# EAGLE design main (EAGLE 9.3.0)
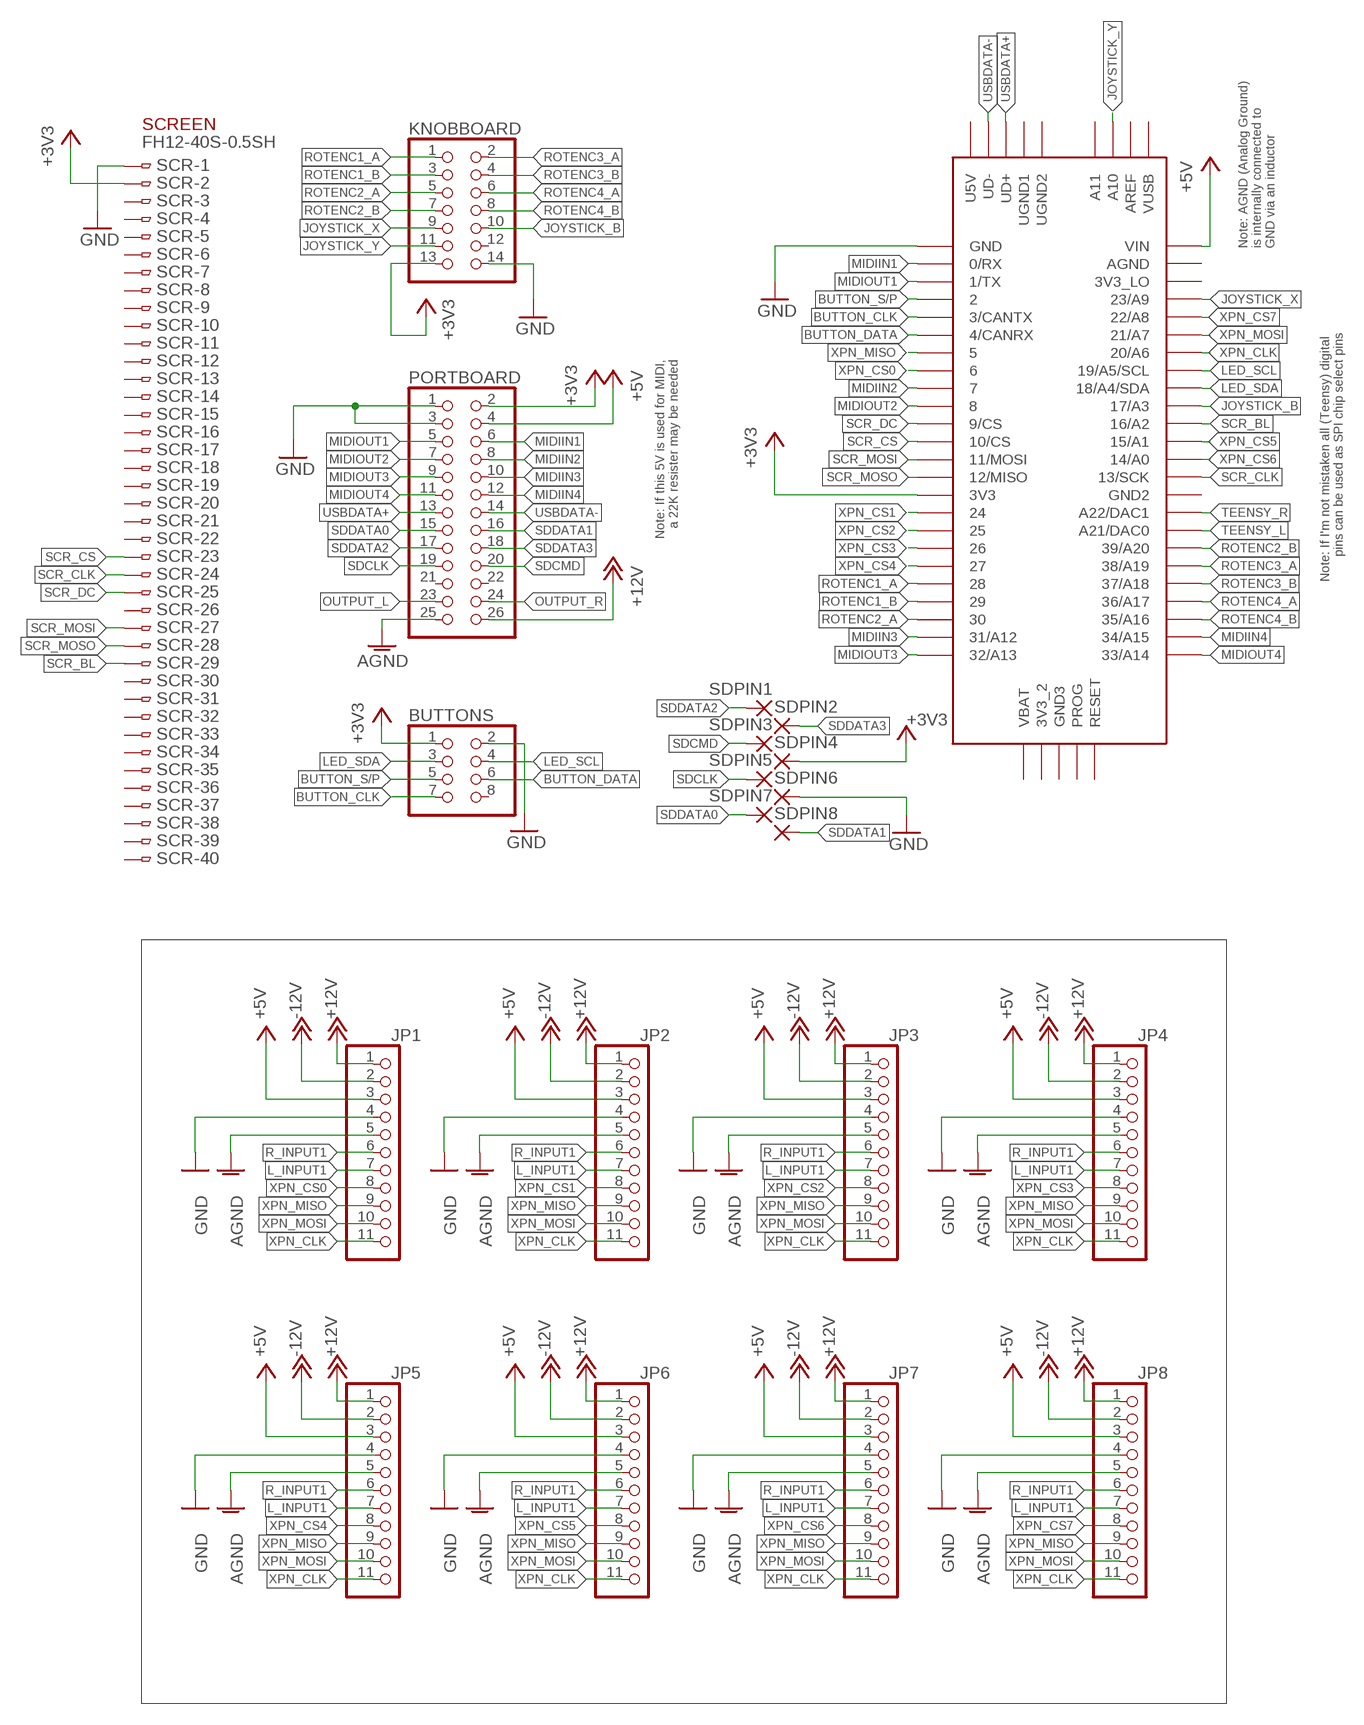
[diagram p0: schematic, sheet 1]

## Parts
BUTTONS  PINHD-2X4  [2X04]
JP1  PINHD-1X11  [1X11]
JP2  PINHD-1X11  [1X11]
JP3  PINHD-1X11  [1X11]
JP4  PINHD-1X11  [1X11]
JP5  PINHD-1X11  [1X11]
JP6  PINHD-1X11  [1X11]
JP7  PINHD-1X11  [1X11]
JP8  PINHD-1X11  [1X11]
KNOBBOARD  PINHD-2X7  [2X07]
PORTBOARD  PINHD-2X13  [2X13]
SCR  FH12-40S-0.5SH  [FH12-40S-0.5SH]
SDPIN1  1,6/0,8  [1,6/0,8]
SDPIN2  1,6/0,8  [1,6/0,8]
SDPIN3  1,6/0,8  [1,6/0,8]
SDPIN4  1,6/0,8  [1,6/0,8]
SDPIN5  1,6/0,8  [1,6/0,8]
SDPIN6  1,6/0,8  [1,6/0,8]
SDPIN7  1,6/0,8  [1,6/0,8]
SDPIN8  1,6/0,8  [1,6/0,8]
TEENSY_3.6  TEENSY_3.5/3.6  [TEENSY_3.5/3.6]

## Nets
+3V3: BUTTONS.1 KNOBBOARD.13 PORTBOARD.2 SCR.2 SDPIN4.1(P) TEENSY_3.6.3V3
+5V: JP1.3 JP2.3 JP3.3 JP4.3 JP5.3 JP6.3 JP7.3 JP8.3 PORTBOARD.4 TEENSY_3.6.VIN
+12V: JP1.1 JP2.1 JP3.1 JP4.1 JP5.1 JP6.1 JP7.1 JP8.1 PORTBOARD.26
-12V: JP1.2 JP2.2 JP3.2 JP4.2 JP5.2 JP6.2 JP7.2 JP8.2
AGND: JP1.5 JP2.5 JP3.5 JP4.5 JP5.5 JP6.5 JP7.5 JP8.5 PORTBOARD.25
BUTTON_CLK: BUTTONS.7 TEENSY_3.6.3/CANTX
BUTTON_DATA: BUTTONS.6 TEENSY_3.6.4/CANRX
BUTTON_S/P: BUTTONS.5 TEENSY_3.6.2
GND: BUTTONS.2 JP1.4 JP2.4 JP3.4 JP4.4 JP5.4 JP6.4 JP7.4 JP8.4 KNOBBOARD.14 PORTBOARD.1 PORTBOARD.3 SCR.1 SDPIN6.1(P) TEENSY_3.6.GND
JOYSTICK_B: KNOBBOARD.10 TEENSY_3.6.17/A3
JOYSTICK_X: KNOBBOARD.9 TEENSY_3.6.23/A9
JOYSTICK_Y: KNOBBOARD.11 TEENSY_3.6.A10
L_INPUT1: JP1.7 JP2.7 JP3.7 JP4.7 JP5.7 JP6.7 JP7.7 JP8.7
LED_SCL: BUTTONS.4 TEENSY_3.6.19/A5/SCL
LED_SDA: BUTTONS.3 TEENSY_3.6.18/A4/SDA
MIDIIN1: PORTBOARD.6 TEENSY_3.6.0/RX
MIDIIN2: PORTBOARD.8 TEENSY_3.6.7
MIDIIN3: PORTBOARD.10 TEENSY_3.6.31/A12
MIDIIN4: PORTBOARD.12 TEENSY_3.6.34/A15
MIDIOUT1: PORTBOARD.5 TEENSY_3.6.1/TX
MIDIOUT2: PORTBOARD.7 TEENSY_3.6.8
MIDIOUT3: PORTBOARD.9 TEENSY_3.6.32/A13
MIDIOUT4: PORTBOARD.11 TEENSY_3.6.33/A14
OUTPUT_L: PORTBOARD.23
OUTPUT_R: PORTBOARD.24
R_INPUT1: JP1.6 JP2.6 JP3.6 JP4.6 JP5.6 JP6.6 JP7.6 JP8.6
ROTENC1_A: KNOBBOARD.1 TEENSY_3.6.28
ROTENC1_B: KNOBBOARD.3 TEENSY_3.6.29
ROTENC2_A: KNOBBOARD.5 TEENSY_3.6.30
ROTENC2_B: KNOBBOARD.7 TEENSY_3.6.39/A20
ROTENC3_A: KNOBBOARD.2 TEENSY_3.6.38/A19
ROTENC3_B: KNOBBOARD.4 TEENSY_3.6.37/A18
ROTENC4_A: KNOBBOARD.6 TEENSY_3.6.36/A17
ROTENC4_B: KNOBBOARD.8 TEENSY_3.6.35/A16
SCR_BL: SCR.29 TEENSY_3.6.16/A2
SCR_CLK: SCR.24 TEENSY_3.6.13/SCK
SCR_CS: SCR.23 TEENSY_3.6.10/CS
SCR_DC: SCR.25 TEENSY_3.6.9/CS
SCR_MOSI: SCR.27 TEENSY_3.6.11/MOSI
SCR_MOSO: SCR.28 TEENSY_3.6.12/MISO
SDCLK: PORTBOARD.19 SDPIN5.1(P)
SDCMD: PORTBOARD.20 SDPIN3.1(P)
SDDATA0: PORTBOARD.15 SDPIN7.1(P)
SDDATA1: PORTBOARD.16 SDPIN8.1(P)
SDDATA2: PORTBOARD.17 SDPIN1.1(P)
SDDATA3: PORTBOARD.18 SDPIN2.1(P)
TEENSY_L: TEENSY_3.6.21/DAC0(A21/DAC0)
TEENSY_R: TEENSY_3.6.A22/DAC1
USBDATA+: PORTBOARD.13 TEENSY_3.6.UD+
USBDATA-: PORTBOARD.14 TEENSY_3.6.UD-
XPN_CLK: JP1.11 JP2.11 JP3.11 JP4.11 JP5.11 JP6.11 JP7.11 JP8.11 TEENSY_3.6.20/A6
XPN_CS0: JP1.8 TEENSY_3.6.6
XPN_CS1: JP2.8 TEENSY_3.6.24
XPN_CS2: JP3.8 TEENSY_3.6.25
XPN_CS3: JP4.8 TEENSY_3.6.26
XPN_CS4: JP5.8 TEENSY_3.6.27
XPN_CS5: JP6.8 TEENSY_3.6.15/A1
XPN_CS6: JP7.8 TEENSY_3.6.14/A0
XPN_CS7: JP8.8 TEENSY_3.6.22/A8
XPN_MISO: JP1.9 JP2.9 JP3.9 JP4.9 JP5.9 JP6.9 JP7.9 JP8.9 TEENSY_3.6.5
XPN_MOSI: JP1.10 JP2.10 JP3.10 JP4.10 JP5.10 JP6.10 JP7.10 JP8.10 TEENSY_3.6.21/A7
Unconnected: BUTTONS.8 KNOBBOARD.12 PORTBOARD.21 PORTBOARD.22 SCR.3 SCR.4 SCR.5 SCR.6 SCR.7 SCR.8 SCR.9 SCR.10 SCR.11 SCR.12 SCR.13 SCR.14 SCR.15 SCR.16 SCR.17 SCR.18 SCR.19 SCR.20 SCR.21 SCR.22 SCR.26 SCR.30 SCR.31 SCR.32 SCR.33 SCR.34 SCR.35 SCR.36 SCR.37 SCR.38 SCR.39 SCR.40 TEENSY_3.6.3V3_2 TEENSY_3.6.3V3_LO TEENSY_3.6.A11 TEENSY_3.6.AGND TEENSY_3.6.AREF TEENSY_3.6.GND2 TEENSY_3.6.GND3 TEENSY_3.6.PROG TEENSY_3.6.RESET TEENSY_3.6.U5V TEENSY_3.6.UGND1 TEENSY_3.6.UGND2 TEENSY_3.6.VBAT TEENSY_3.6.VUSB

## Notes on the sheet
- SCREEN
- Note: AGND (Analog Ground) 
  is internally connected to 
  GND via an inductor
- Note: If I'm not mistaken all (Teensy) digital 
  pins can be used as SPI chip select pins
- Note: If this 5V is used for MIDI,
  a 22K resister may be needed

## Library data of the parts
BUTTONS = pinhead:PINHD-2X4: PIN HEADER
JP1-JP8 = pinhead:PINHD-1X11: PIN HEADER
KNOBBOARD = pinhead:PINHD-2X7: PIN HEADER
PORTBOARD = pinhead:PINHD-2X13: PIN HEADER
SCR = con-hirose:FH12-40S-0.5S: 0.5mm Pitch Connectors For FPC/FFC Source: Data sheet <http://www.hirose.co.jp/cataloge_hp/e58605370.pdf>; MPN: FH12-40S-0.5SH(55); OC_FARNELL: 1324556; OC_NEWARK: 34M6178
SDPIN1-SDPIN8 = wirepad:1,6/0,8: THROUGH-HOLE PAD
TEENSY_3.6 = Teensy356:TEENSY_3.5/3.6

## Board
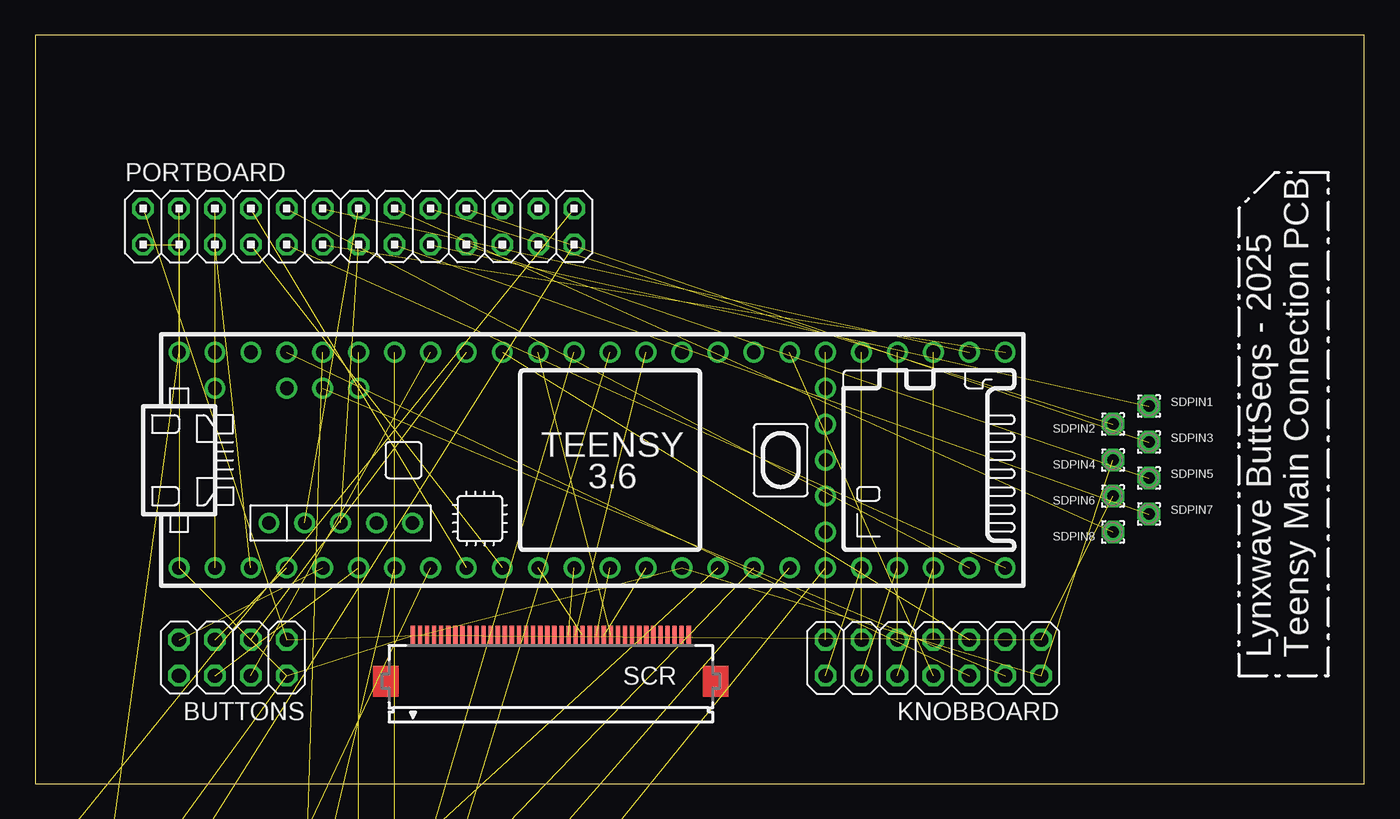
[diagram p1: board, top side]
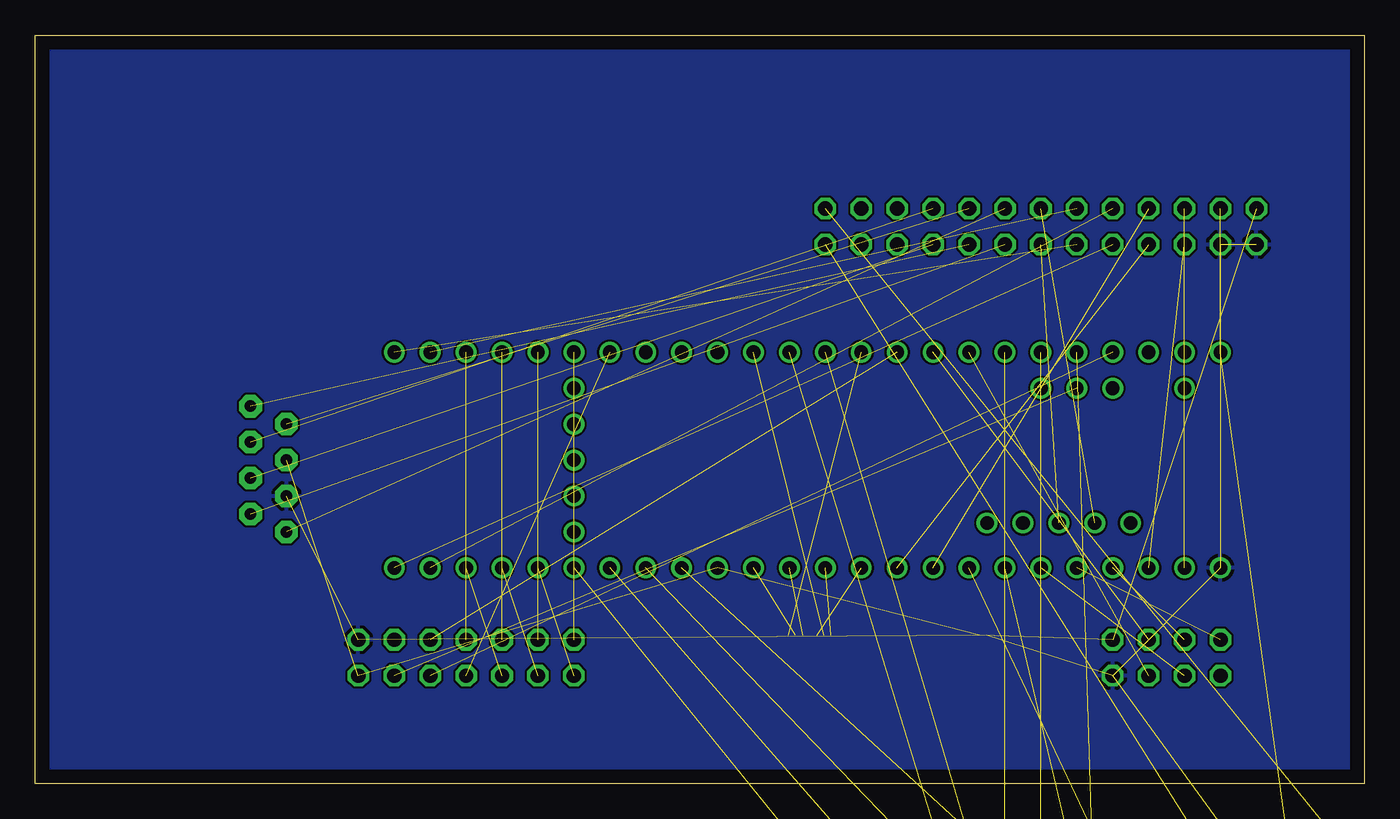
[diagram p2: board, bottom side, seen from below]

Size 93.96 x 52.88 mm. Coordinates in mm from the lower left corner, seen from the top.
Outline: 0,0 93.96,0 93.96,52.88 0,52.88 0,0
Copper layers (1*16): Top 0.035mm / dielectric 1.5mm / Bottom 0.035mm
Design rules "default *": minimum track width 0.2mm, minimum drill 0.35mm, track to track 6mil, track to pad 6mil, pad to pad 6mil, via to via 6mil, smd to smd 6mil, copper to edge 40mil, drill to drill 6mil, minimum pad ring 10mil, minimum via ring 8mil, stop-mask expansion 4mil, vias tented up to drill 0mil, thermal gap 10mil

### Footprints (pad centres in the part's own frame; a part is rotated, then mirrored left to right if it is on the bottom)
2X04 = drill 1.016 octagon: 1 -3.81,-1.27; 2 -3.81,1.27; 3 -1.27,-1.27; 4 -1.27,1.27; 5 1.27,-1.27; 6 1.27,1.27; 7 3.81,-1.27; 8 3.81,1.27
1X11 = drill 1.016 long: 1 -12.7,0; 2 -10.16,0; 3 -7.62,0; 4 -5.08,0; 5 -2.54,0; 6 0,0; 7 2.54,0; 8 5.08,0; 9 7.62,0; 10 10.16,0; 11 12.7,0
2X07 = drill 1.016 octagon: 1 -7.62,-1.27; 2 -7.62,1.27; 3 -5.08,-1.27; 4 -5.08,1.27; 5 -2.54,-1.27; 6 -2.54,1.27; 7 0,-1.27; 8 0,1.27; 9 2.54,-1.27; 10 2.54,1.27; 11 5.08,-1.27; 12 5.08,1.27; 13 7.62,-1.27; 14 7.62,1.27
2X13 = drill 1.016 octagon: 1 -15.24,-1.27; 2 -15.24,1.27; 3 -12.7,-1.27; 4 -12.7,1.27; 5 -10.16,-1.27; 6 -10.16,1.27; 7 -7.62,-1.27; 8 -7.62,1.27; 9 -5.08,-1.27; 10 -5.08,1.27; 11 -2.54,-1.27; 12 -2.54,1.27; 13 0,-1.27; 14 0,1.27; 15 2.54,-1.27; 16 2.54,1.27; 17 5.08,-1.27; 18 5.08,1.27; 19 7.62,-1.27; 20 7.62,1.27; 21 10.16,-1.27; 22 10.16,1.27; 23 12.7,-1.27; 24 12.7,1.27; 25 15.24,-1.27; 26 15.24,1.27
FH12-40S-0.5SH = smd 0.3 x 1.3: 1 -9.75,3.25; 2 -9.25,3.25; 3 -8.75,3.25; 4 -8.25,3.25; 5 -7.75,3.25; 6 -7.25,3.25; 7 -6.75,3.25; 8 -6.25,3.25; 9 -5.75,3.25; 10 -5.25,3.25; 11 -4.75,3.25; 12 -4.25,3.25; 13 -3.75,3.25; 14 -3.25,3.25; 15 -2.75,3.25; 16 -2.25,3.25; 17 -1.75,3.25; 18 -1.25,3.25; 19 -0.75,3.25; 20 -0.25,3.25; 21 0.25,3.25; 22 0.75,3.25; 23 1.25,3.25; 24 1.75,3.25; 25 2.25,3.25; 26 2.75,3.25; 27 3.25,3.25; 28 3.75,3.25; 29 4.25,3.25; 30 4.75,3.25; 31 5.25,3.25; 32 5.75,3.25; 33 6.25,3.25; 34 6.75,3.25; 35 7.25,3.25; 36 7.75,3.25; 37 8.25,3.25; 38 8.75,3.25; 39 9.25,3.25; 40 9.75,3.25
1,6/0,8 = drill 0.813 pad 1.6 octagon: 1 0,0
TEENSY_3.5/3.6 = drill 0.965: 0/RX -25.4,-7.62; 1/TX -22.86,-7.62; 2 -20.32,-7.62; 3/CANTX -17.78,-7.62; 3V3 7.62,-7.62; 3V3_2 17.78,-2.54; 3V3_LO -22.86,7.62; 4/CANRX -15.24,-7.62; 5 -12.7,-7.62; 6 -10.16,-7.62; 7 -7.62,-7.62; 8 -5.08,-7.62; 9/CS -2.54,-7.62; 10/CS 0,-7.62; 11/MOSI 2.54,-7.62; 12/MISO 5.08,-7.62; 13/SCK 5.08,7.62; 14/A0 2.54,7.62; 15/A1 0,7.62; 16/A2 -2.54,7.62; 17/A3 -5.08,7.62; 18/A4/SDA -7.62,7.62; 19/A5/SCL -10.16,7.62; 20/A6 -12.7,7.62; 21/A7 -15.24,7.62; 21/DAC0 12.7,7.62; 22/A8 -17.78,7.62; 23/A9 -20.32,7.62; 24 10.16,-7.62; 25 12.7,-7.62; 26 15.24,-7.62; 27 17.78,-7.62; 28 20.32,-7.62; 29 22.86,-7.62; 30 25.4,-7.62; 31/A12 27.94,-7.62; 32/A13 30.48,-7.62; 33/A14 30.48,7.62; 34/A15 27.94,7.62; 35/A16 25.4,7.62; 36/A17 22.86,7.62; 37/A18 20.32,7.62; 38/A19 17.78,7.62; 39/A20 15.24,7.62; A10 -17.78,5.08; A11 -15.24,5.08; A22/DAC1 10.16,7.62; AGND -25.4,7.62; AREF -20.32,5.08; GND -27.94,-7.62; GND2 7.62,7.62; GND3 17.78,0; PROG 17.78,2.54; RESET 17.78,5.08; U5V -21.59,-4.445; UD+ -16.51,-4.445; UD- -19.05,-4.445; UGND1 -13.97,-4.445; UGND2 -11.43,-4.445; VBAT 17.78,-5.08; VIN -27.94,7.62; VUSB -25.4,5.08

### Placement (x,y rotation side)
BUTTONS  13.97,8.89 180 top
JP1  12.7,-6.35 0 top  (outside the outline)
JP2  12.7,-12.7 0 top  (outside the outline)
JP3  12.7,-19.05 0 top  (outside the outline)
JP4  12.7,-25.4 0 top  (outside the outline)
JP5  12.7,-31.75 0 top  (outside the outline)
JP6  12.7,-38.1 0 top  (outside the outline)
JP7  12.7,-44.45 0 top  (outside the outline)
JP8  12.7,-50.8 0 top  (outside the outline)
KNOBBOARD  63.5,8.89 0 top
PORTBOARD  22.86,39.37 0 top
SCR  36.45,7.24 0 top
SDPIN1  78.74,26.67 0 top
SDPIN2  76.2,25.4 0 top
SDPIN3  78.74,24.13 0 top
SDPIN4  76.2,22.86 0 top
SDPIN5  78.74,21.59 0 top
SDPIN6  76.2,20.32 0 top
SDPIN7  78.74,19.05 0 top
SDPIN8  76.2,17.78 0 top
TEENSY_3.6  38.1,22.86 0 top

### Tracks (layer width: path | path; a pad name or v marks a point on that pad's centre or on a via)
+3V3  (5 unrouted)
+5V  (9 unrouted)
+12V  (8 unrouted)
-12V  (7 unrouted)
AGND  (8 unrouted)
BUTTON_CLK  (1 unrouted)
BUTTON_DATA  (1 unrouted)
BUTTON_S/P  (1 unrouted)
GND  (14 unrouted)
  pour Bottom: -2.54,54.61 95.25,54.61 95.25,-1.27 -2.54,-1.27
JOYSTICK_B  (1 unrouted)
JOYSTICK_X  (1 unrouted)
JOYSTICK_Y  (1 unrouted)
L_INPUT1  (7 unrouted)
LED_SCL  (1 unrouted)
LED_SDA  (1 unrouted)
MIDIIN1  (1 unrouted)
MIDIIN2  (1 unrouted)
MIDIIN3  (1 unrouted)
MIDIIN4  (1 unrouted)
MIDIOUT1  (1 unrouted)
MIDIOUT2  (1 unrouted)
MIDIOUT3  (1 unrouted)
MIDIOUT4  (1 unrouted)
R_INPUT1  (7 unrouted)
ROTENC1_A  (1 unrouted)
ROTENC1_B  (1 unrouted)
ROTENC2_A  (1 unrouted)
ROTENC2_B  (1 unrouted)
ROTENC3_A  (1 unrouted)
ROTENC3_B  (1 unrouted)
ROTENC4_A  (1 unrouted)
ROTENC4_B  (1 unrouted)
SCR_BL  (1 unrouted)
SCR_CLK  (1 unrouted)
SCR_CS  (1 unrouted)
SCR_DC  (1 unrouted)
SCR_MOSI  (1 unrouted)
SCR_MOSO  (1 unrouted)
SDCLK  (1 unrouted)
SDCMD  (1 unrouted)
SDDATA0  (1 unrouted)
SDDATA1  (1 unrouted)
SDDATA2  (1 unrouted)
SDDATA3  (1 unrouted)
USBDATA+  (1 unrouted)
USBDATA-  (1 unrouted)
XPN_CLK  (8 unrouted)
XPN_CS0  (1 unrouted)
XPN_CS1  (1 unrouted)
XPN_CS2  (1 unrouted)
XPN_CS3  (1 unrouted)
XPN_CS4  (1 unrouted)
XPN_CS5  (1 unrouted)
XPN_CS6  (1 unrouted)
XPN_CS7  (1 unrouted)
XPN_MISO  (8 unrouted)
XPN_MOSI  (8 unrouted)

### Text on the board
tPlace: Lynxwave ButtSeqs - 2025 / Teensy Main Connection PCB